# Altium schematic sheet v2上.SchDoc
size A4; SheetNumber: 1; SheetTotal: 1
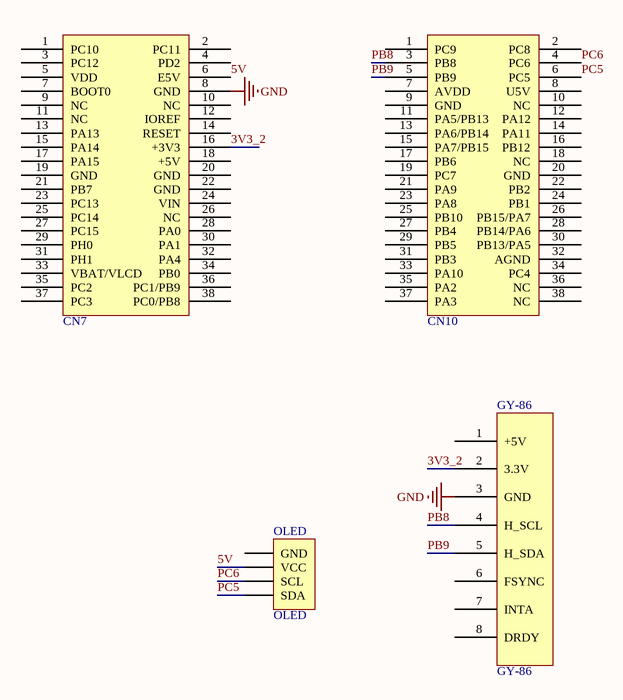
[diagram p0: v2上.SchDoc]

## Parts
?  CN10  [CN10]
CN7  CN7  [CN7]  (value not drawn)
GY-86  GY-86  [GY-86]
OLED  OLED  [HDR1X4]

## Nets
GND: CN7.8(GND) GY-86.3(GND)
3V3_2: CN7.16(+3V3) GY-86.2(3.3V)
5V: CN7.6(E5V) OLED.2(VCC)
PB8: ?.3(PB8) GY-86.4(H_SCL)
PB9: ?.5(PB9) GY-86.5(H_SDA)
PC5: ?.6(PC5) OLED.4(SDA)
PC6: ?.4(PC6) OLED.3(SCL)

Not connected (* = marked no-connect by the designer): ? 1(PC9) 2(PC8) 7(AVDD) 8(U5V) 9(GND) 10(NC) 11(PA5/PB13) 12(PA12) 13(PA6/PB14) 14(PA11) 15(PA7/PB15) 16(PB12) 17(PB6) 18(NC) 19(PC7) 20(GND) 21(PA9) 22(PB2) 23(PA8) 24(PB1) 25(PB10) 26(PB15/PA7) 27(PB4) 28(PB14/PA6) 29(PB5) 30(PB13/PA5) 31(PB3) 32(AGND) 33(PA10) 34(PC4) 35(PA2) 36(NC) 37(PA3) 38(NC); CN7 1(PC10) 2(PC11) 3(PC12) 4(PD2) 5(VDD) 7(BOOT0) 9(NC) 10(NC) 11(NC) 12(IOREF) 13(PA13) 14(RESET) 15(PA14) 17(PA15) 18(+5V) 19(GND) 20(GND) 21(PB7) 22(GND) 23(PC13) 24(VIN) 25(PC14) 26(NC) 27(PC15) 28(PA0) 29(PH0) 30(PA1) 31(PH1) 32(PA4) 33(VBAT/VLCD) 34(PB0) 35(PC2) 36(PC1/PB9) 37(PC3) 38(PC0/PB8); GY-86 1(+5V) 6(FSYNC) 7(INTA) 8(DRDY); OLED 1(GND)

## Library data of the parts
OLED = Header 4: Header, 4-Pin; LatestRevisionDate: 17-Jul-2002; LatestRevisionNote: Re-released for DXP Platform.; Publisher: Altium Limited